# Altium schematic sheet sensor.SchDoc
size A3; Organization: Altium Limited; Address1: L3, 12a Rodborough Rd; Address2: Frenchs Forest; Address3: NSW; Address4: Australia 2086
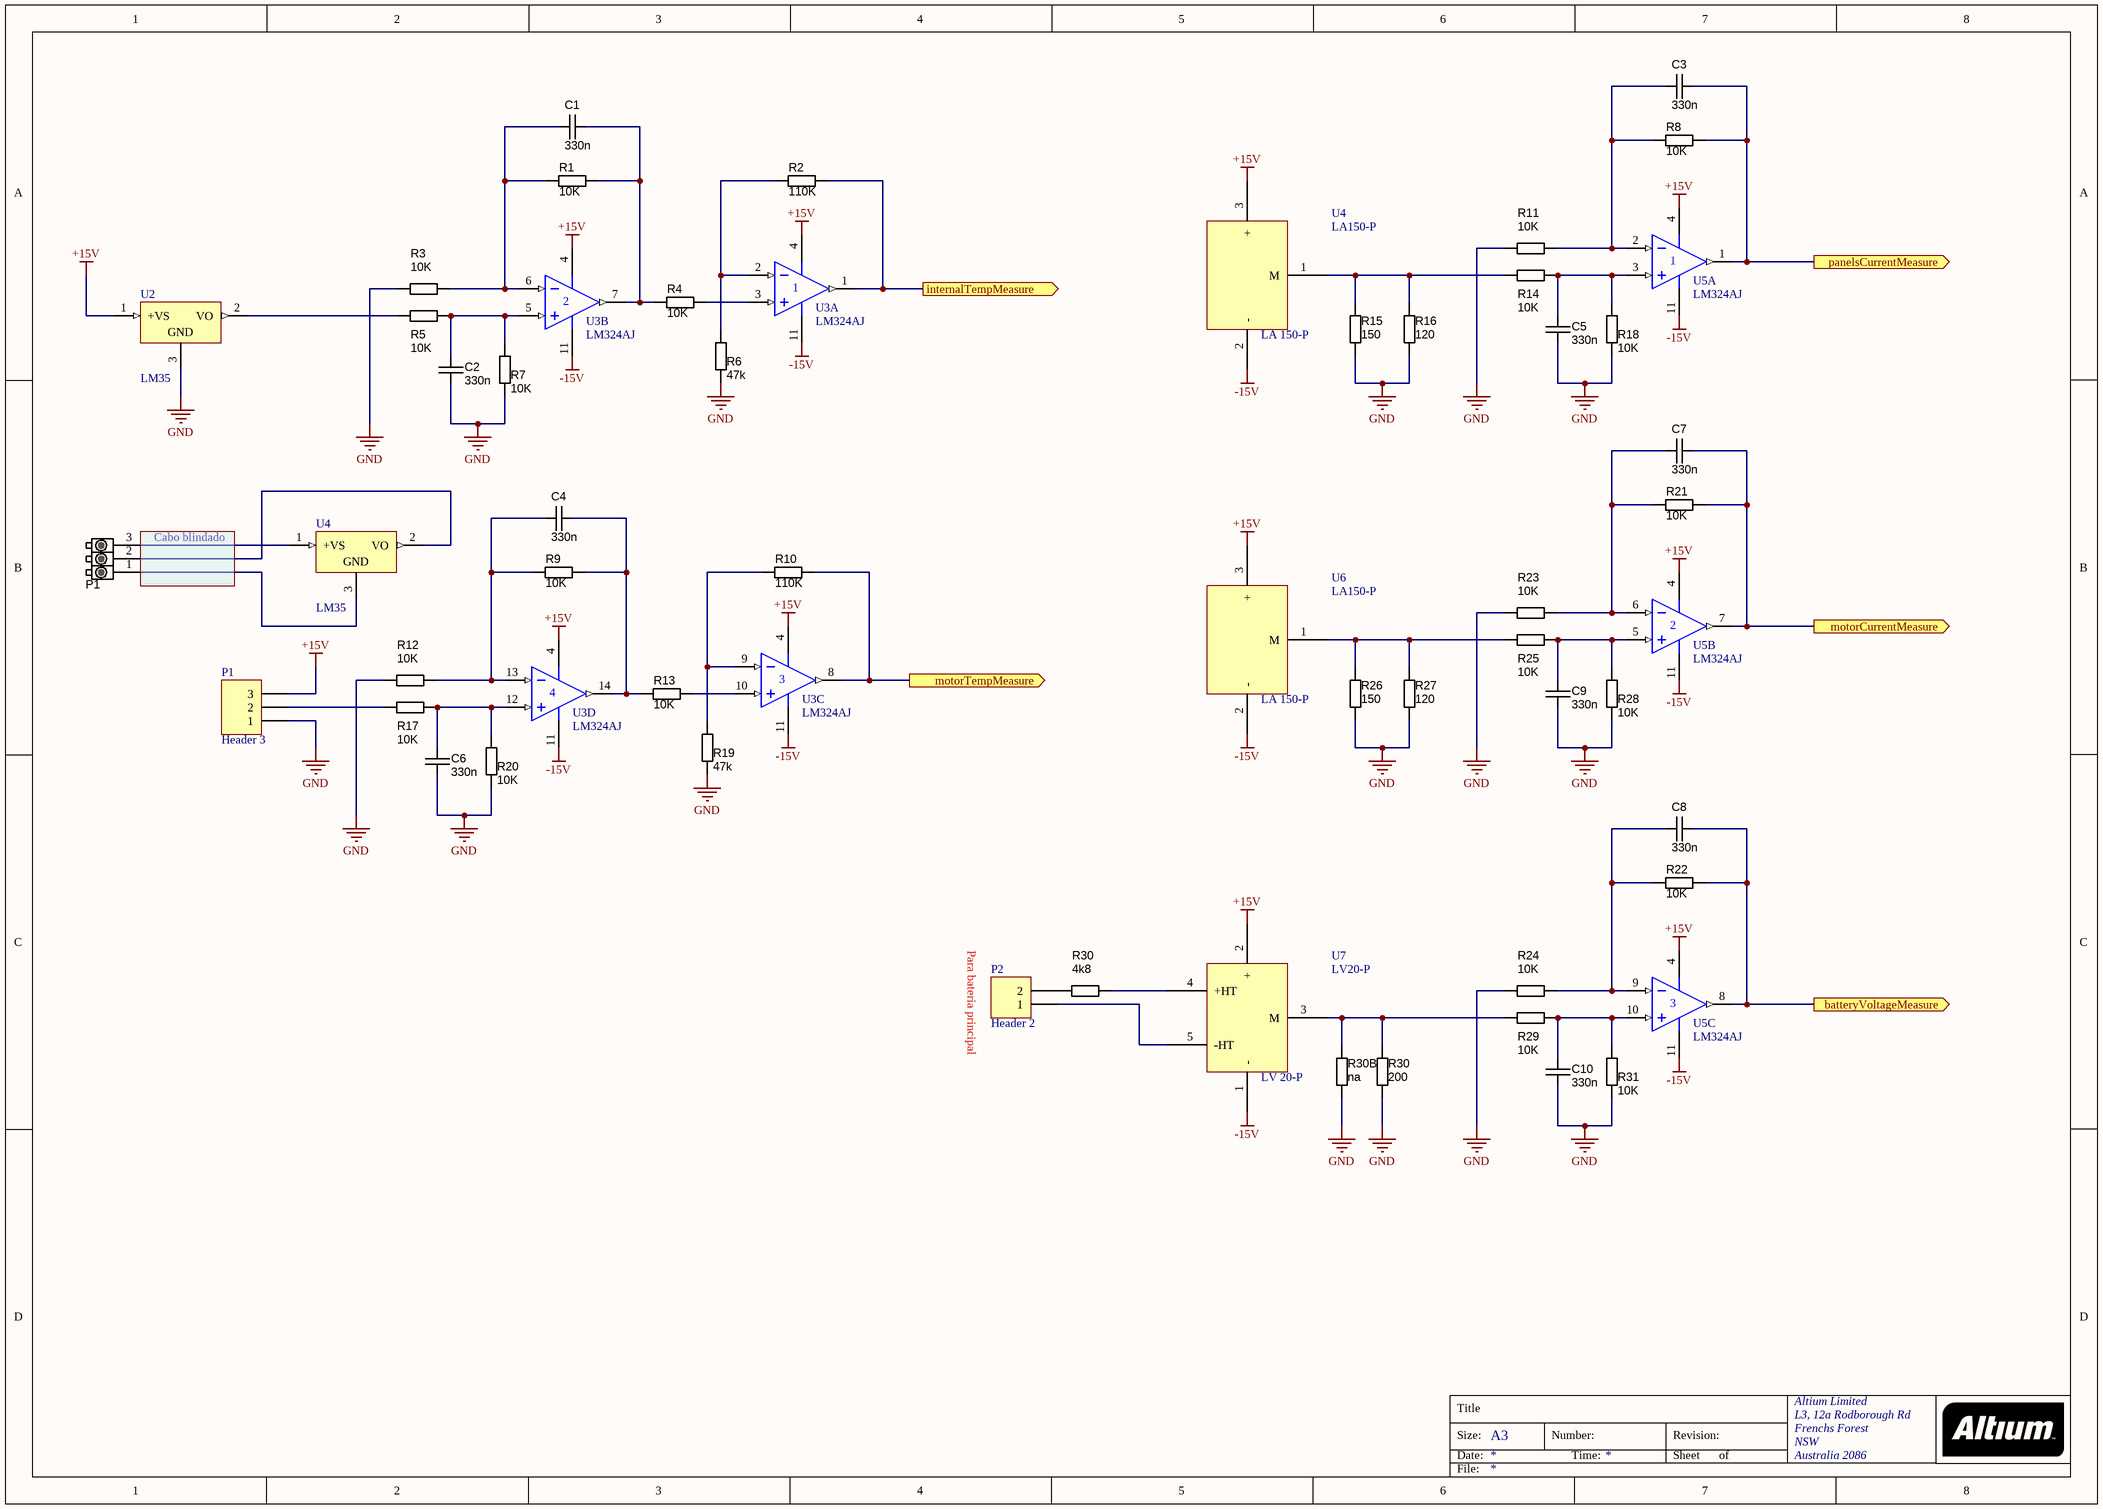
[diagram p0: sensor.SchDoc]

## Parts
(Parts that share a designator on the sheet are numbered #1, #2 ... from top to bottom, then left to right.)
C1  value 330n  [cap33n63v]  (hidden comment: approved sub OK)
C2  value 330n  [cap33n63v]  (hidden comment: approved sub OK)
C3  value 330n  [cap33n63v]  (hidden comment: approved sub OK)
C4  value 330n  [cap33n63v]  (hidden comment: approved sub OK)
C5  value 330n  [cap33n63v]  (hidden comment: approved sub OK)
C6  value 330n  [cap33n63v]  (hidden comment: approved sub OK)
C7  value 330n  [cap33n63v]  (hidden comment: approved sub OK)
C8  value 330n  [cap33n63v]  (hidden comment: approved sub OK)
C9  value 330n  [cap33n63v]  (hidden comment: approved sub OK)
C10  value 330n  [cap33n63v]  (hidden comment: approved sub OK)
P1#1  3P_TERM BLOCK PLUG  (value not drawn)  (graphical)
P1#2  Header 3  [HDR1X3]
P2  Header 2  [HDR1X2]
R1  value 10K  [RESTH_AXIAL-0.4]  (hidden comment: Carbon Film)
R2  value 110K  [RESTH_AXIAL-0.4]  (hidden comment: Carbon Film)
R3  value 10K  [RESTH_AXIAL-0.4]  (hidden comment: Carbon Film)
R4  value 10K  [RESTH_AXIAL-0.4]  (hidden comment: Carbon Film)
R5  value 10K  [RESTH_AXIAL-0.4]  (hidden comment: Carbon Film)
R6  value 47k  [RESTH_AXIAL-0.4]  (hidden comment: Carbon Film)
R7  value 10K  [RESTH_AXIAL-0.4]  (hidden comment: Carbon Film)
R8  value 10K  [RESTH_AXIAL-0.4]  (hidden comment: Carbon Film)
R9  value 10K  [RESTH_AXIAL-0.4]  (hidden comment: Carbon Film)
R10  value 110K  [RESTH_AXIAL-0.4]  (hidden comment: Carbon Film)
R11  value 10K  [RESTH_AXIAL-0.4]  (hidden comment: Carbon Film)
R12  value 10K  [RESTH_AXIAL-0.4]  (hidden comment: Carbon Film)
R13  value 10K  [RESTH_AXIAL-0.4]  (hidden comment: Carbon Film)
R14  value 10K  [RESTH_AXIAL-0.4]  (hidden comment: Carbon Film)
R15  value 150  [RESTH_AXIAL-0.4]  (hidden comment: Carbon Film)
R16  value 120  [RESTH_AXIAL-0.4]  (hidden comment: Carbon Film)
R17  value 10K  [RESTH_AXIAL-0.4]  (hidden comment: Carbon Film)
R18  value 10K  [RESTH_AXIAL-0.4]  (hidden comment: Carbon Film)
R19  value 47k  [RESTH_AXIAL-0.4]  (hidden comment: Carbon Film)
R20  value 10K  [RESTH_AXIAL-0.4]  (hidden comment: Carbon Film)
R21  value 10K  [RESTH_AXIAL-0.4]  (hidden comment: Carbon Film)
R22  value 10K  [RESTH_AXIAL-0.4]  (hidden comment: Carbon Film)
R23  value 10K  [RESTH_AXIAL-0.4]  (hidden comment: Carbon Film)
R24  value 10K  [RESTH_AXIAL-0.4]  (hidden comment: Carbon Film)
R25  value 10K  [RESTH_AXIAL-0.4]  (hidden comment: Carbon Film)
R26  value 150  [RESTH_AXIAL-0.4]  (hidden comment: Carbon Film)
R27  value 120  [RESTH_AXIAL-0.4]  (hidden comment: Carbon Film)
R28  value 10K  [RESTH_AXIAL-0.4]  (hidden comment: Carbon Film)
R29  value 10K  [RESTH_AXIAL-0.4]  (hidden comment: Carbon Film)
R30#1  value 4k8  [RESTH_AXIAL-0.4]  (hidden comment: Carbon Film)
R30#2  value 200  [RESTH_AXIAL-0.4]  (hidden comment: Carbon Film)
R30B  value na  [RESTH_AXIAL-0.4]  (hidden comment: Carbon Film)
R31  value 10K  [RESTH_AXIAL-0.4]  (hidden comment: Carbon Film)
U2  LM35  [Z03A]
U3  LM324AJ  [J014]  (parts A,B,C,D of 4)
U4#1  LA150-P  [LA150-P]
U4#2  LM35  [Z03A]  (graphical)
U5  LM324AJ  [J014]  (parts A,B,C of 4)
U6  LA150-P  [LA150-P]
U7  LV20-P  [LV20-P]

## Ports
batteryVoltageMeasure (out), internalTempMeasure (out), motorCurrentMeasure (out), motorTempMeasure (out), panelsCurrentMeasure (out)

## Nets
+15V: P1#2.3 U2.1(+VS) U3.4(V+) U4#1.3(+) U5.4(V+) U6.3(+) U7.2(+)
-15V: U3.11(V-) U4#1.2(-) U5.11(V-) U6.2(-) U7.1(-)
GND: C2.2 C5.2 C6.2 C9.2 C10.2 P1#2.1 R3.1 R6.2 R7.2 R11.1 R12.1 R15.2 R16.2 R18.2 R19.2 R20.2 R23.1 R24.1 R26.2 R27.2 R28.2 R30#2.2 R30B.2 R31.2 U2.3(GND)
batteryVoltageMeasure: C8.2 R22.2 U5.8(OUT) ; port batteryVoltageMeasure
internalTempMeasure: R2.1 U3.1(OUT) ; port internalTempMeasure
motorCurrentMeasure: C7.2 R21.2 U5.7(OUT) ; port motorCurrentMeasure
motorTempMeasure: R10.1 U3.8(OUT) ; port motorTempMeasure
panelsCurrentMeasure: C3.2 R8.2 U5.1(OUT) ; port panelsCurrentMeasure
NetC1_1: C1.1 R1.1 R3.2 U3.6(IN-)
NetC1_2: C1.2 R1.2 R4.2 U3.7(OUT)
NetC2_1: C2.1 R5.2 R7.1 U3.5(IN+)
NetC3_1: C3.1 R8.1 R11.2 U5.2(IN-)
NetC4_1: C4.1 R9.1 R12.2 U3.13(IN-)
NetC4_2: C4.2 R9.2 R13.2 U3.14(OUT)
NetC5_1: C5.1 R14.2 R18.1 U5.3(IN+)
NetC6_1: C6.1 R17.2 R20.1 U3.12(IN+)
NetC7_1: C7.1 R21.1 R23.2 U5.6(IN-)
NetC8_1: C8.1 R22.1 R24.2 U5.9(IN-)
NetC9_1: C9.1 R25.2 R28.1 U5.5(IN+)
NetC10_1: C10.1 R29.2 R31.1 U5.10(IN+)
NetP1#1_1: P1#1.1 U4#2.3(GND)
NetP1#1_2: P1#1.2 U4#2.2(VO)
NetP1#1_3: P1#1.3 U4#2.1(+VS)
NetP1#2_2: P1#2.2 R17.1
NetP2_1: P2.1 U7.5(-HT)
NetP2_2: P2.2 R30#1.1
NetR2_2: R2.2 R6.1 U3.2(IN-)
NetR4_1: R4.1 U3.3(IN+)
NetR5_1: R5.1 U2.2(VO)
NetR10_2: R10.2 R19.1 U3.9(IN-)
NetR13_1: R13.1 U3.10(IN+)
NetR14_1: R14.1 R15.1 R16.1 U4#1.1(M)
NetR25_1: R25.1 R26.1 R27.1 U6.1(M)
NetR29_1: R29.1 R30#2.1 R30B.1 U7.3(M)
NetR30#1_2: R30#1.2 U7.4(+HT)

## Notes on the sheet
- (near P1#1) Cabo blindado
- Para bateria principal
- Title
- Size:
- Date:
- A3
- Number:
- Time:
- Revision:
- Sheet
- of
- File:
- (in symbol LA150-P) LA 150-P
- (in symbol LV20-P) LV 20-P

## Library data of the parts
C1-C10 = CAPC_330n_0805: Capacitor SMD Cer 330nF 10% 25V X7R 0805; Manufacturer: Kemet; Manufacturer Part Number: C0805C334K3RACTU; Ratings: 25V; X7R; Material: ceramic; Package / Case: 0805 (2012 metric); Tolerance: ±10%; Supplier 1: Mouser; Supplier Part Number 1: 80-C0805C334K3R
P1#1 = 3P_TERM BLOCK PLUG: Terminal block plug 3-position 3.81mm pitch; Manufacturer 1: TE Connectivity; Manufacturer Part Number 1: 284507-3; Pitch: 0.150" (3.81mm); Voltage: 300V; Mating Connector: 284517-3; Value: 3 position; Positions Per Level: 3; Plug Wire Entry: 180°; Wire Gauge: 14-30 AWG; Category: Connectors; Mounting Type: Free Hanging (In-Line); Terminal Block Type: Plug, Female Sockets; Supplier 1: Digi-Key; Supplier Part Number 1: A98380-ND; ComponentLink2URL: http://www.te.com/commerce/DocumentDelivery/DDEController?Action=srchrtrv&DocNm=284507&DocType=Customer+Drawing&DocLang=English; ComponentLink2Description: http://www.te.com/commerce/DocumentDelivery/DDEController?Action=srchrtrv&DocNm=284507&DocType=Customer+Drawing&DocLang=English
P1#2 = Header 3: Header, 3-Pin; LatestRevisionDate: 17-Jul-2002; LatestRevisionNote: Re-released for DXP Platform.; Publisher: Altium Limited
P2 = Header 2: Header, 2-Pin; LatestRevisionDate: 17-Jul-2002; LatestRevisionNote: Re-released for DXP Platform.; Publisher: Altium Limited
R1-R29 R30#1 R30#2 R30B R31 = RES_1K_Axial_0.25W_5%: Resistor THD Axial 1k Ohm 0.25W 5% Carbon Film; Manufacturer 1: Yageo; Manufacturer Part Number 1: CFR-25JB-1K0; Ratings: 1/4W; Tolerance: ±5%; Package / Case: Axial; Supplier 1: Digi-Key; Supplier Part Number 1: 1.0KQBK-ND
U2 U4#2 = LM35CAZ: Precision Centigrade Temperature Sensor, 3-pin TO-92; Manufacturer: National Semiconductor; PackageTopMarking: NSXYTT*LM35*CAZ; PowerWise: N; CompType: Temp Sensor IC; Published: 4-Dec-2008; LatestRevisionDate: 15-Jul-2009; LatestRevisionNote: Sch pins 1 & 3 reversed.; DatasheetVersion: Nov-2000; PackageVersion: revG, Sep-2000; PackageReference: Z03A; Publisher: Altium Limited; PackageDescription: TO-92, Molded, 3 Lead; Supplier 1: Farnell; Supplier Part Number 1: 9494529; PartNumber: LM35CAZ; RoHS: N; PinCount: 3; Code_JEDEC: TO-226-AA; ComponentLink1Description: LM35 Datasheet; ComponentLink1URL: http://www.national.com/ds/LM/LM35.pdf; ComponentLink2Description: LM35 Web Page; ComponentLink2URL: http://www.national.com/pf/LM/LM35.html; ComponentLink3Description: Z03A Package Page; ComponentLink3URL: http://www.national.com/packaging/folders/z03a.html
U3 U5 = LM324AJ: Quadruple Operational Amplifier; Published: 15-Apr-2002; LatestRevisionDate: 04-Mar-2005; LatestRevisionNote: Stylized 3D Model Added.; DatasheetVersion: Jan-1989; PackageVersion: Jun-1999; PackageReference: J014; Publisher: Altium Limited; PackageDescription: DIP; 14 Leads; Row Spacing 7.62 mm; Pitch 2.54 mm; ComponentLink1Description: Manufacturer Link; ComponentLink1URL: http://www.ti.com/; ComponentLink2Description: Datasheet; ComponentLink2URL: http://www-s.ti.com/sc/ds/lm324.pdf
U4#1 U6 = LA150-P: Current Transducer
U7 = LV20-P: Voltage Transducer